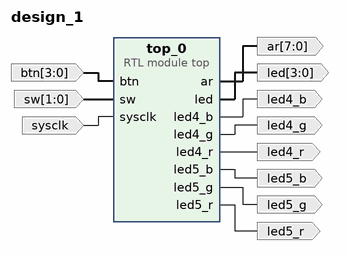
[diagram p0: block diagram of the top level]
# Vivado block design design_1, xc7z020clg400-1, Vivado 2021.2
create_bd_design design_1

create_bd_port -dir I -type clk sysclk
set_property -dict {CONFIG.FREQ_HZ 125000000} [get_bd_ports sysclk]
create_bd_port -dir I -from 1 -to 0 sw
create_bd_port -dir I -from 3 -to 0 btn
create_bd_port -dir O -from 3 -to 0 led
create_bd_port -dir O led4_b
create_bd_port -dir O led4_g
create_bd_port -dir O led4_r
create_bd_port -dir O led5_b
create_bd_port -dir O led5_g
create_bd_port -dir O led5_r
create_bd_port -dir O -from 7 -to 0 ar

create_bd_cell -type module -reference top top_0

# ---- connections ----

connect_bd_net [get_bd_ports btn] [get_bd_pins top_0/btn]
connect_bd_net [get_bd_ports sw] [get_bd_pins top_0/sw]
connect_bd_net [get_bd_ports sysclk] [get_bd_pins top_0/sysclk]
connect_bd_net [get_bd_pins top_0/ar] [get_bd_ports ar]
connect_bd_net [get_bd_pins top_0/led] [get_bd_ports led]
connect_bd_net [get_bd_pins top_0/led4_b] [get_bd_ports led4_b]
connect_bd_net [get_bd_pins top_0/led4_g] [get_bd_ports led4_g]
connect_bd_net [get_bd_pins top_0/led4_r] [get_bd_ports led4_r]
connect_bd_net [get_bd_pins top_0/led5_b] [get_bd_ports led5_b]
connect_bd_net [get_bd_pins top_0/led5_g] [get_bd_ports led5_g]
connect_bd_net [get_bd_pins top_0/led5_r] [get_bd_ports led5_r]

validate_bd_design
save_bd_design
